# Altium project Fastino.PrjPCB (part 2 of 6)

## Sheet Fastino_FPGA.SchDoc: Fastino
size 420 x 297 mm; EDA_Number: ARTIQ; Projet: Fastino; Author: G.Kasprowicz; CompanyName: WUT ISE; DrawnBy: G.Kasprowicz; Organization: WUT ISE; Address1: PW ISE; Address2: Nowowiejska 15/19 00-665 Warsaw; Address3: gkasprow@gmail.com; DocumentNumber: 3; Revision: 2; SheetNumber: 3; SheetTotal: 8; ModifiedBy: -; CheckedDate: -; Title2: 3.3V FPGA banks; DivGrp: WUT ISE; Designer: G.Kasprowicz; ModifiedDate: -; ProjectName: Sensor Box
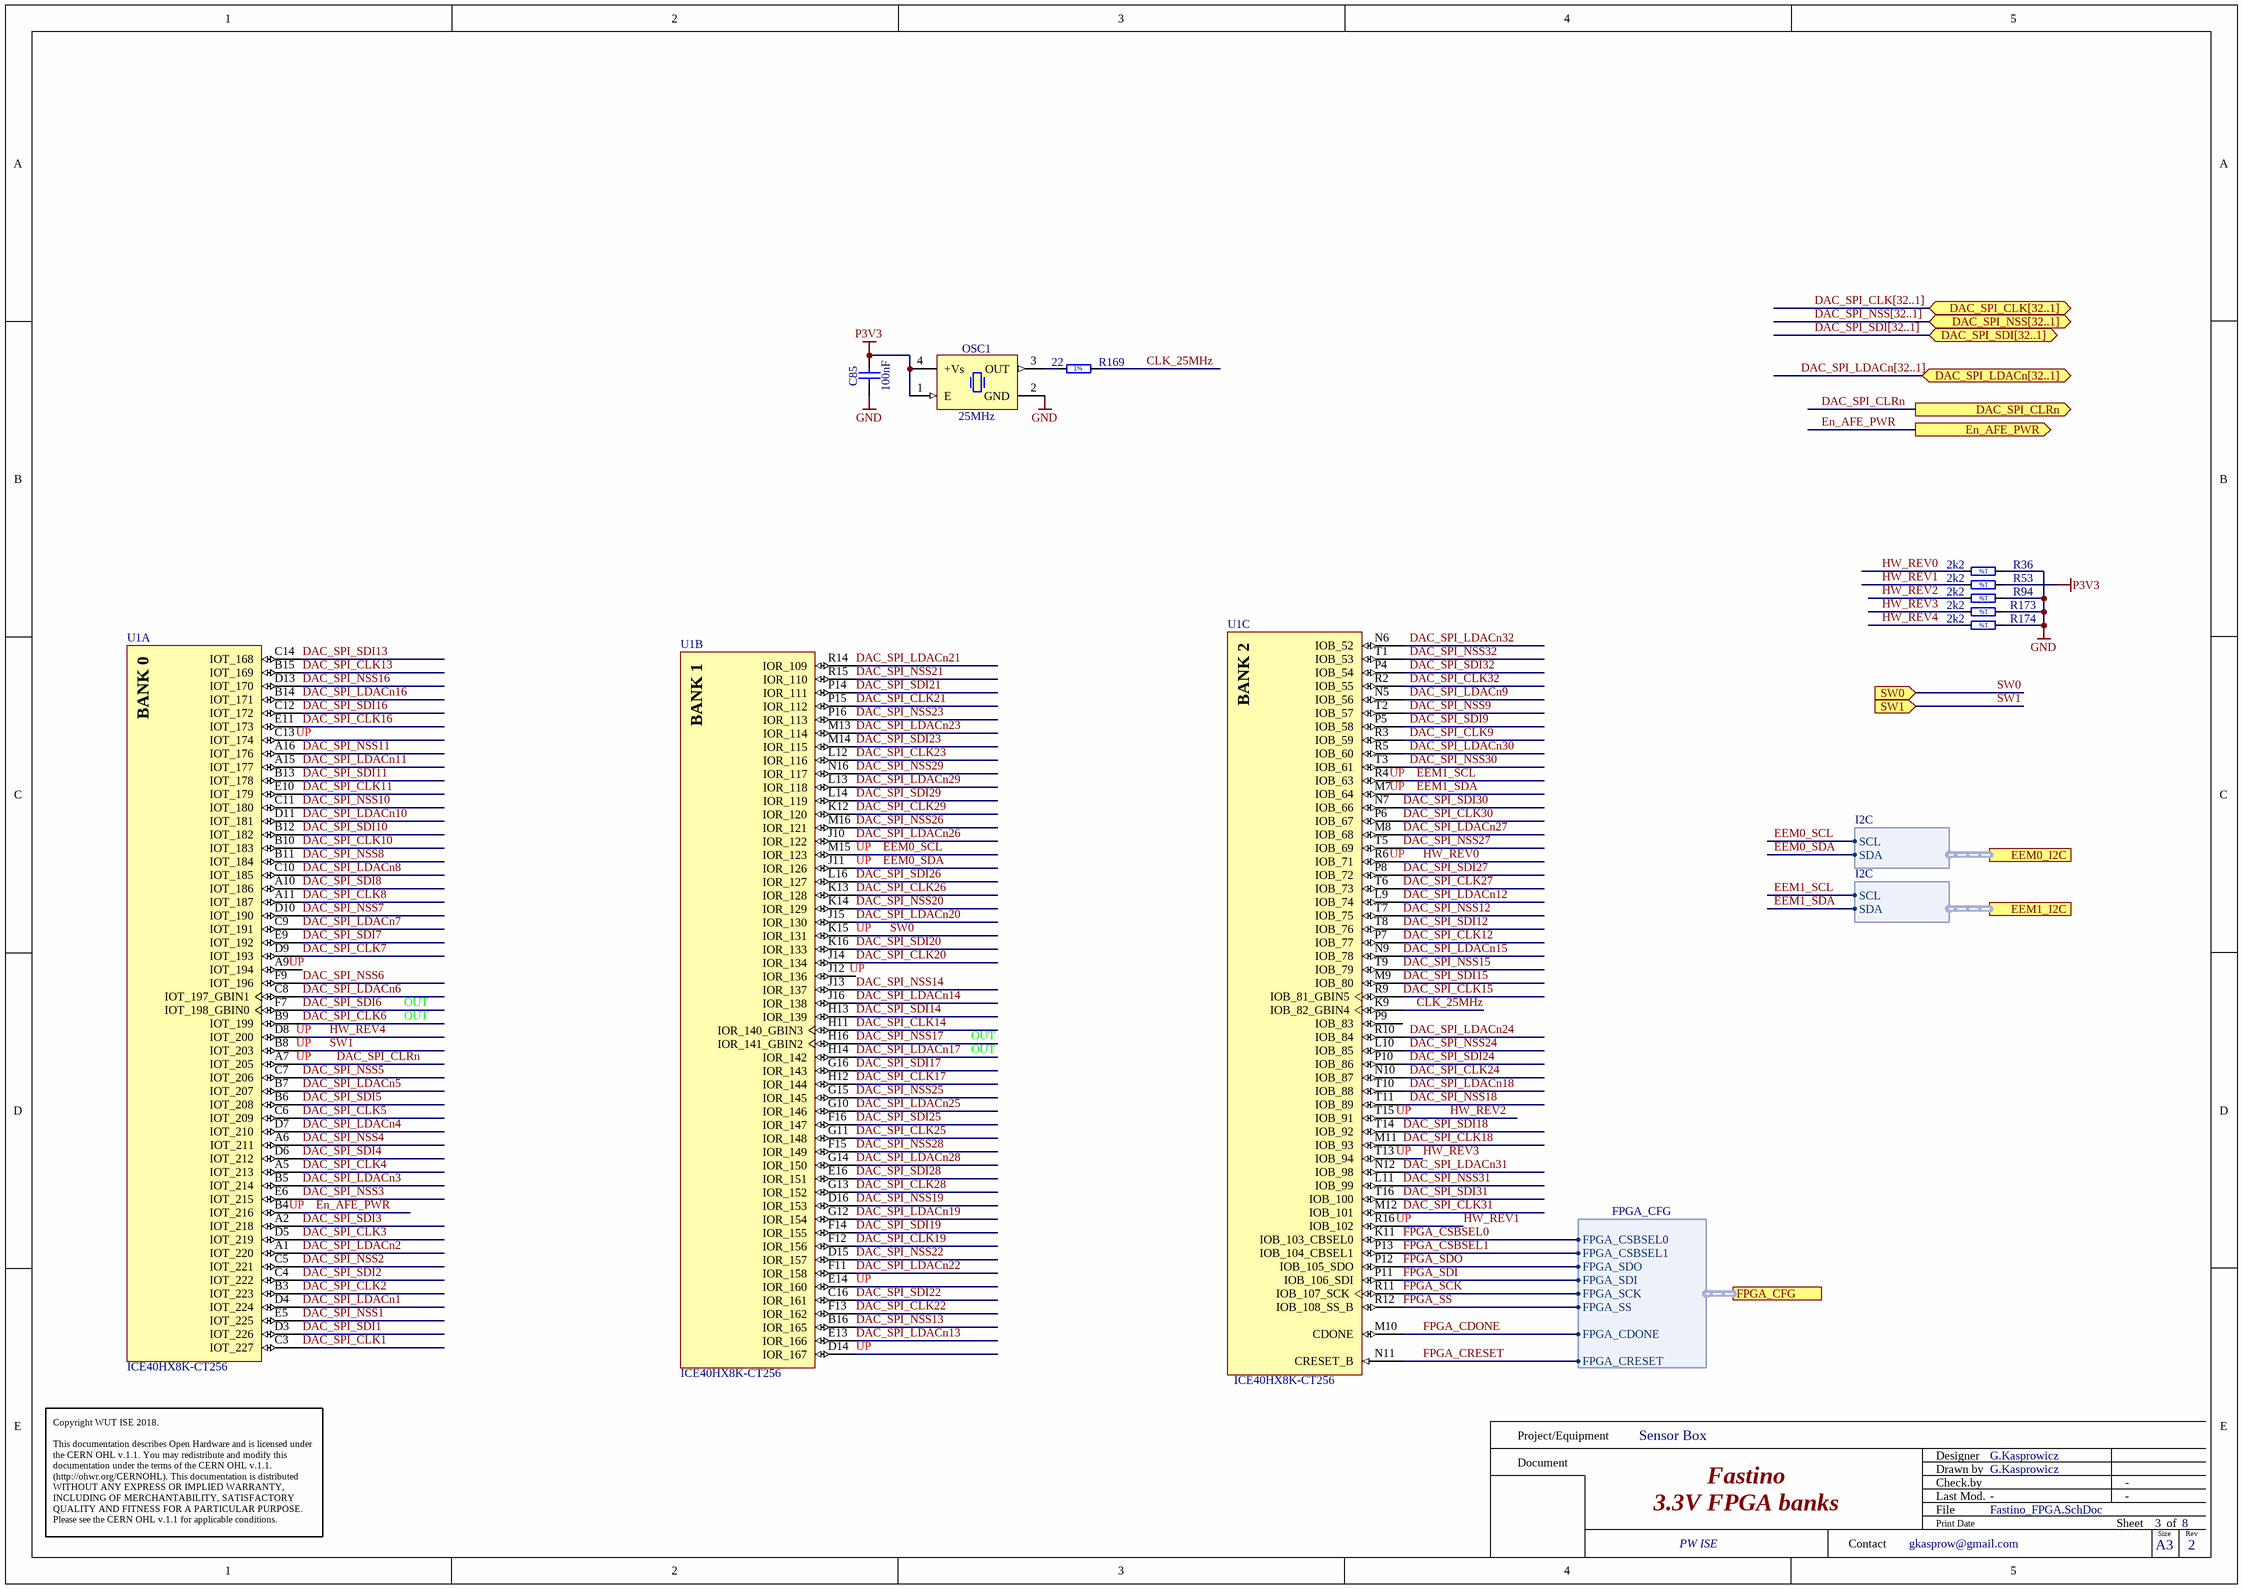
[diagram p2: Fastino_FPGA.SchDoc]

### Parts
C85  100nF  [CAPC1005X55N]
OSC1  25MHz  [OSC_IQD_CFPS-39]
R36  2k2  [RESC1005X40N]
R53  2k2  [RESC1005X40N]
R94  2k2  [RESC1005X40N]
R169  22  [RESC1005X40N]
R173  2k2  [RESC1005X40N]
R174  2k2  [RESC1005X40N]
U1  ICE40HX8K-CT256  [LATC-caBGA-256]  (parts A,B,C of 5)

### Ports
DAC_SPI_CLK[32..1] (bidir), DAC_SPI_CLRn (out), DAC_SPI_LDACn[32..1] (bidir), DAC_SPI_NSS[32..1] (bidir), DAC_SPI_SDI[32..1] (bidir), EEM0_I2C (harness I2C), EEM1_I2C (harness I2C), En_AFE_PWR (out), FPGA_CFG (harness FPGA_CFG), SW0 (in), SW1 (in)

### Harnesses
FPGA_CFG: FPGA_CSBSEL0, FPGA_CSBSEL1, FPGA_SDO, FPGA_SDI, FPGA_SCK, FPGA_SS, FPGA_CDONE, FPGA_CRESET
I2C: SDA, SCL

### Nets
GND: C85.1 OSC1.2(GND) R36.1 R94.1 R173.1 R174.1
P3V3: C85.2 OSC1.1(E) OSC1.4(+Vs) R53.1
CLK_25MHz: R169.2 U1.K9(IOB_82_GBIN4)
DAC_SPI_CLK1: U1.C3(IOT_227)
DAC_SPI_CLK2: U1.B3(IOT_223)
DAC_SPI_CLK3: U1.D5(IOT_219)
DAC_SPI_CLK4: U1.A5(IOT_213)
DAC_SPI_CLK5: U1.C6(IOT_209)
DAC_SPI_CLK6: U1.B9(IOT_199)
DAC_SPI_CLK7: U1.D9(IOT_193)
DAC_SPI_CLK8: U1.A11(IOT_187)
DAC_SPI_CLK9: U1.R3(IOB_59)
DAC_SPI_CLK10: U1.B10(IOT_183)
DAC_SPI_CLK11: U1.E10(IOT_179)
DAC_SPI_CLK12: U1.P7(IOB_77)
DAC_SPI_CLK13: U1.B15(IOT_169)
DAC_SPI_CLK14: U1.H11(IOR_140_GBIN3)
DAC_SPI_CLK15: U1.R9(IOB_81_GBIN5)
DAC_SPI_CLK16: U1.E11(IOT_173)
DAC_SPI_CLK17: U1.H12(IOR_144)
DAC_SPI_CLK18: U1.M11(IOB_93)
DAC_SPI_CLK19: U1.F12(IOR_156)
DAC_SPI_CLK20: U1.J14(IOR_134)
DAC_SPI_CLK21: U1.P15(IOR_112)
DAC_SPI_CLK22: U1.F13(IOR_162)
DAC_SPI_CLK23: U1.L12(IOR_116)
DAC_SPI_CLK24: U1.N10(IOB_87)
DAC_SPI_CLK25: U1.G11(IOR_148)
DAC_SPI_CLK26: U1.K13(IOR_128)
DAC_SPI_CLK27: U1.T6(IOB_73)
DAC_SPI_CLK28: U1.G13(IOR_152)
DAC_SPI_CLK29: U1.K12(IOR_120)
DAC_SPI_CLK30: U1.P6(IOB_67)
DAC_SPI_CLK31: U1.M12(IOB_101)
DAC_SPI_CLK32: U1.R2(IOB_55)
DAC_SPI_CLRn: U1.A7(IOT_205) ; port DAC_SPI_CLRn
DAC_SPI_LDACn1: U1.D4(IOT_224)
DAC_SPI_LDACn2: U1.A1(IOT_220)
DAC_SPI_LDACn3: U1.B5(IOT_214)
DAC_SPI_LDACn4: U1.D7(IOT_210)
DAC_SPI_LDACn5: U1.B7(IOT_207)
DAC_SPI_LDACn6: U1.C8(IOT_197_GBIN1)
DAC_SPI_LDACn7: U1.C9(IOT_191)
DAC_SPI_LDACn8: U1.C10(IOT_185)
DAC_SPI_LDACn9: U1.N5(IOB_56)
DAC_SPI_LDACn10: U1.D11(IOT_181)
DAC_SPI_LDACn11: U1.A15(IOT_177)
DAC_SPI_LDACn12: U1.L9(IOB_74)
DAC_SPI_LDACn13: U1.E13(IOR_166)
DAC_SPI_LDACn14: U1.J16(IOR_138)
DAC_SPI_LDACn15: U1.N9(IOB_78)
DAC_SPI_LDACn16: U1.B14(IOT_171)
DAC_SPI_LDACn17: U1.H14(IOR_142)
DAC_SPI_LDACn18: U1.T10(IOB_88)
DAC_SPI_LDACn19: U1.G12(IOR_154)
DAC_SPI_LDACn20: U1.J15(IOR_130)
DAC_SPI_LDACn21: U1.R14(IOR_109)
DAC_SPI_LDACn22: U1.F11(IOR_158)
DAC_SPI_LDACn23: U1.M13(IOR_114)
DAC_SPI_LDACn24: U1.R10(IOB_84)
DAC_SPI_LDACn25: U1.G10(IOR_146)
DAC_SPI_LDACn26: U1.J10(IOR_122)
DAC_SPI_LDACn27: U1.M8(IOB_68)
DAC_SPI_LDACn28: U1.G14(IOR_150)
DAC_SPI_LDACn29: U1.L13(IOR_118)
DAC_SPI_LDACn30: U1.R5(IOB_60)
DAC_SPI_LDACn31: U1.N12(IOB_98)
DAC_SPI_LDACn32: U1.N6(IOB_52)
DAC_SPI_NSS1: U1.E5(IOT_225)
DAC_SPI_NSS2: U1.C5(IOT_221)
DAC_SPI_NSS3: U1.E6(IOT_215)
DAC_SPI_NSS4: U1.A6(IOT_211)
DAC_SPI_NSS5: U1.C7(IOT_206)
DAC_SPI_NSS6: U1.F9(IOT_196)
DAC_SPI_NSS7: U1.D10(IOT_190)
DAC_SPI_NSS8: U1.B11(IOT_184)
DAC_SPI_NSS9: U1.T2(IOB_57)
DAC_SPI_NSS10: U1.C11(IOT_180)
DAC_SPI_NSS11: U1.A16(IOT_176)
DAC_SPI_NSS12: U1.T7(IOB_75)
DAC_SPI_NSS13: U1.B16(IOR_165)
DAC_SPI_NSS14: U1.J13(IOR_137)
DAC_SPI_NSS15: U1.T9(IOB_79)
DAC_SPI_NSS16: U1.D13(IOT_170)
DAC_SPI_NSS17: U1.H16(IOR_141_GBIN2)
DAC_SPI_NSS18: U1.T11(IOB_89)
DAC_SPI_NSS19: U1.D16(IOR_153)
DAC_SPI_NSS20: U1.K14(IOR_129)
DAC_SPI_NSS21: U1.R15(IOR_110)
DAC_SPI_NSS22: U1.D15(IOR_157)
DAC_SPI_NSS23: U1.P16(IOR_113)
DAC_SPI_NSS24: U1.L10(IOB_85)
DAC_SPI_NSS25: U1.G15(IOR_145)
DAC_SPI_NSS26: U1.M16(IOR_121)
DAC_SPI_NSS27: U1.T5(IOB_69)
DAC_SPI_NSS28: U1.F15(IOR_149)
DAC_SPI_NSS29: U1.N16(IOR_117)
DAC_SPI_NSS30: U1.T3(IOB_61)
DAC_SPI_NSS31: U1.L11(IOB_99)
DAC_SPI_NSS32: U1.T1(IOB_53)
DAC_SPI_SDI1: U1.D3(IOT_226)
DAC_SPI_SDI2: U1.C4(IOT_222)
DAC_SPI_SDI3: U1.A2(IOT_218)
DAC_SPI_SDI4: U1.D6(IOT_212)
DAC_SPI_SDI5: U1.B6(IOT_208)
DAC_SPI_SDI6: U1.F7(IOT_198_GBIN0)
DAC_SPI_SDI7: U1.E9(IOT_192)
DAC_SPI_SDI8: U1.A10(IOT_186)
DAC_SPI_SDI9: U1.P5(IOB_58)
DAC_SPI_SDI10: U1.B12(IOT_182)
DAC_SPI_SDI11: U1.B13(IOT_178)
DAC_SPI_SDI12: U1.T8(IOB_76)
DAC_SPI_SDI13: U1.C14(IOT_168)
DAC_SPI_SDI14: U1.H13(IOR_139)
DAC_SPI_SDI15: U1.M9(IOB_80)
DAC_SPI_SDI16: U1.C12(IOT_172)
DAC_SPI_SDI17: U1.G16(IOR_143)
DAC_SPI_SDI18: U1.T14(IOB_92)
DAC_SPI_SDI19: U1.F14(IOR_155)
DAC_SPI_SDI20: U1.K16(IOR_133)
DAC_SPI_SDI21: U1.P14(IOR_111)
DAC_SPI_SDI22: U1.C16(IOR_161)
DAC_SPI_SDI23: U1.M14(IOR_115)
DAC_SPI_SDI24: U1.P10(IOB_86)
DAC_SPI_SDI25: U1.F16(IOR_147)
DAC_SPI_SDI26: U1.L16(IOR_127)
DAC_SPI_SDI27: U1.P8(IOB_72)
DAC_SPI_SDI28: U1.E16(IOR_151)
DAC_SPI_SDI29: U1.L14(IOR_119)
DAC_SPI_SDI30: U1.N7(IOB_66)
DAC_SPI_SDI31: U1.T16(IOB_100)
DAC_SPI_SDI32: U1.P4(IOB_54)
EEM0_SCL: U1.M15(IOR_123) ; port EEM0_I2C.SCL
EEM0_SDA: U1.J11(IOR_126) ; port EEM0_I2C.SDA
EEM1_SCL: U1.R4(IOB_63) ; port EEM1_I2C.SCL
EEM1_SDA: U1.M7(IOB_64) ; port EEM1_I2C.SDA
En_AFE_PWR: U1.B4(IOT_216) ; port En_AFE_PWR
FPGA_CDONE: U1.M10(CDONE) ; port FPGA_CFG.FPGA_CDONE
FPGA_CRESET: U1.N11(CRESET_B) ; port FPGA_CFG.FPGA_CRESET
FPGA_CSBSEL0: U1.K11(IOB_103_CBSEL0) ; port FPGA_CFG.FPGA_CSBSEL0
FPGA_CSBSEL1: U1.P13(IOB_104_CBSEL1) ; port FPGA_CFG.FPGA_CSBSEL1
FPGA_SCK: U1.R11(IOB_107_SCK) ; port FPGA_CFG.FPGA_SCK  [project net FLASH_SCK]
FPGA_SDI: U1.P11(IOB_106_SDI) ; port FPGA_CFG.FPGA_SDI  [project net FLASH_SDO]
FPGA_SDO: U1.P12(IOB_105_SDO) ; port FPGA_CFG.FPGA_SDO  [project net FLASH_SDI]
FPGA_SS: U1.R12(IOB_108_SS_B) ; port FPGA_CFG.FPGA_SS  [project net FLASH_SS]
HW_REV0: R36.2 U1.R6(IOB_71)
HW_REV1: R53.2 U1.R16(IOB_102)
HW_REV2: R94.2 U1.T15(IOB_91)
HW_REV3: R173.2 U1.T13(IOB_94)
HW_REV4: R174.2 U1.D8(IOT_200)
SW0: U1.K15(IOR_131) ; port SW0
SW1: U1.B8(IOT_203) ; port SW1
NetOSC1_3: OSC1.3(OUT) R169.1

Not connected (* = marked no-connect by the designer): U1 A9(IOT_194) C13(IOT_174) D14(IOR_167) E14(IOR_160) J12(IOR_136) P9(IOB_83)

### Buses and harness runs
bus DAC_SPI_CLK[32..1] = port DAC_SPI_CLK[32..1]
bus DAC_SPI_LDACn[32..1] = port DAC_SPI_LDACn[32..1]
bus DAC_SPI_NSS[32..1] = port DAC_SPI_NSS[32..1]
bus DAC_SPI_SDI[32..1] = port DAC_SPI_SDI[32..1]

### Notes on the sheet
- (near U1) UP
- OUT
- Project/Equipment
- Document
- Designer
- Drawn by
- Check.by
- Copyright WUT ISE 2018.
  This documentation describes Open Hardware and is licensed under the CERN OHL v.1.1. You may redistribute and modify this documentation under the terms of the CERN OHL v.1.1. (http://ohwr.org/CERNOHL). This documentation is distributed WITHOUT ANY EXPRESS OR IMPLIED WARRANTY, INCLUDING OF MERCHANTABILITY, SATISFACTORY QUALITY AND FITNESS FOR A PARTICULAR PURPOSE. Please see the CERN OHL v.1.1 for applicable conditions.
- Contact
- File
- Last Mod.
- Print Date
- Sheet
- Size
- A3
- of
- Rev
- (in symbol CMP-0962-00001-1, part A) BANK 0
- (in symbol CMP-0962-00001-1, part B) BANK 1
- (in symbol CMP-0962-00001-1, part C) BANK 2
- (in symbol R0402_2K2_1%_0.0625W_100PPM) 1%
- (in symbol R0402_22R_1%_0.0625W_100PPM) 1%

### Library data of the parts
C85 = CC0402_100NF_16V_10%_X5R: Non-polarised capacitor; Part Description: SMD Multilayer Chip Ceramic Capacitor; Manufacturer: GENERIC; Manufacturer1 Part Number: GRM155R61C104KA88D; Voltage: 16V; TC: X5R; Tolerance: ±10%; Part Number: CC0402_100NF_16V_10%_X5R; Component Kind: Standard; Component Type: Standard; Pin Count: 2; Value: 100nF; Status: None; Manufacturer Part Number: CC0402_100NF_16V_10%_X5R; Case: 0402; Mounted: Yes; Socket: No; SMD: Yes; Sense: No; Manufacturer1 Example: MURATA; Manufacturer1 ComponentHeight: 0.55mm; HelpURL: \\cern.ch\dfs\Applications\Altium\Datasheets\CC0402_X5R_MURATA_GRM.pdf; Author: CERN DEM JLC; CreateDate: 10.12.2013; LatestRevisionDate: 10.12.2013
OSC1 = OSC_25MHZ_IQD_LFSPXO025165: Oscillator 4 pins 1=E 2=GND 3=OUT 4=+Vs; Part Description: 3.3V, ±50ppm, 15pF, -40 to 85°C, CMOS Surface Mount Clock Oscillator (CFPS-39 Series); Manufacturer: IQD FREQUENCY PRODUCTS; PressFit: No; Bonding: No; Part Number: OSC_25MHZ_IQD_LFSPXO025165; Component Kind: Standard; Component Type: Standard; PackageDescription: Oscillator, Corner Concave, 2.20mm Pitch, 4 Pins, 2.70mm L X 3.40mm W X 1.20mm H, CFPS-39 Series; Value: 25MHz; Manufacturer Part Number: LFSPXO025165; Pin Count: 4; Mounted: Yes; Socket: No; SMD: Yes; Sense: No; ComponentHeight: 1.2mm; HelpURL: \\cern.ch\dfs\Applications\Altium\Datasheets\OSC_IQD_LFSPXO025165.pdf; Author: CERN DEM JLC; CreateDate: 02.12.2010; LatestRevisionDate: 03.11.2016
R36 R53 R94 R173 R174 = R0402_2K2_1%_0.0625W_100PPM: Resistor - 1%; Part Description: General Purpose Thick Film Chip Resistor; Manufacturer: GENERIC; Manufacturer1 Part Number: 232270672202L; TC: ±100ppm/°C; Table: Resistors SMD; Part Number: R0402_2K2_1%_0.0625W_100PPM; Component Kind: Standard; Component Type: Standard; Pin Count: 2; Value: 2k2; Status: Not recommended; Power: 0.0625W; Tolerance: ±1%; Manufacturer Part Number: R0402_2K2_1%_0.0625W_100PPM; Case: 0402; Mounted: Yes; Socket: No; SMD: Yes; Manufacturer1 Example: YAGEO PHYCOMP; Manufacturer1 ComponentHeight: 0.4mm; HelpURL: \\cern.ch\dfs\Applications\Altium\Datasheets\R0402_Phycomp_RC0402.pdf; Author: CERN DEM JLC; CreateDate: 2007-12-03; LatestRevisionDate: 2012-10-17
R169 = R0402_22R_1%_0.0625W_100PPM: Resistor - 1%; Part Description: General Purpose Thick Film Chip Resistor; Manufacturer: GENERIC; Manufacturer1 Part Number: 232270672209L; TC: ±100ppm/°C; PressFit: No; Part Number: R0402_22R_1%_0.0625W_100PPM; Component Kind: Standard; Component Type: Standard; Pin Count: 2; Value: 22; Status: Not Recommended; Power: 0.0625W; Tolerance: ±1%; Manufacturer Part Number: R0402_22R_1%_0.0625W_100PPM; Case: 0402; Mounted: Yes; Sense: No; Socket: No; SMD: Yes; Manufacturer1 Example: YAGEO PHYCOMP; Manufacturer1 ComponentHeight: 0.4mm; HelpURL: \\cern.ch\dfs\Applications\Altium\Datasheets\R0402_Phycomp_RC0402.pdf; Author: CERN DEM JLC; CreateDate: 03/12/2007; LatestRevisionDate: 17/10/2012
U1 = CMP-0962-00001-1: iCE40 HX8K Series FPGA Family, 7680 Logic Cells, 1.2 V Core, 128 K Embedded RAM Bits, 256-ball caBGA, Pb-Free, Tray; Manufacturer: Lattice Semiconductor; Supply Voltage: 1.2V; Phase-Locked Loops: 2; Logic Cells: 7680; Embedded RAM Bits: 128K; PackageReference: caBGA-256; PackageDescription: 256-Ball Chip Array Ball Grid Array, Body 14 x 14 mm, Pitch 0.8 mm; RoHS: TRUE; Packing: Tray; Mounting Technology: Surface Mount; ComponentLink3URL: http://www.latticesemi.com/lit/docs/package/pkg.pdf; ComponentLink1Description: Manufacturer URL; ComponentLink3Description: Package Specification; Code_JEDEC: MO-275; PackageVersion: Rev. 03.9, 02/2013; ComponentLink1URL: http://www.latticesemi.com/en; ComponentLink2URL: http://www.latticesemi.com/~/media/Documents/DataSheets/iCE/iCE40LPHXFamilyDataSheet.pdf; PartNumber: ICE40HX8K-CT256; ComponentLink2Description: Datasheet; DatasheetVersion: Rev. 02.9

## Sheet Fastino_FPGA_Config.SchDoc: Fastino
size 420 x 297 mm; EDA_Number: ARTIQ; Projet: Fastino; Author: G.Kasprowicz; CompanyName: WUT ISE; DrawnBy: G.Kasprowicz; Organization: WUT ISE; Address1: PW ISE; Address2: Nowowiejska 15/19 00-665 Warsaw; Address3: gkasprow@gmail.com; DocumentNumber: 5; Revision: 2; SheetNumber: 8; SheetTotal: 12; ModifiedBy: -; CheckedDate: -; Title2: FPGA Configuration; DivGrp: WUT ISE; Designer: G.Kasprowicz; ModifiedDate: -; ProjectName: Sensor Box
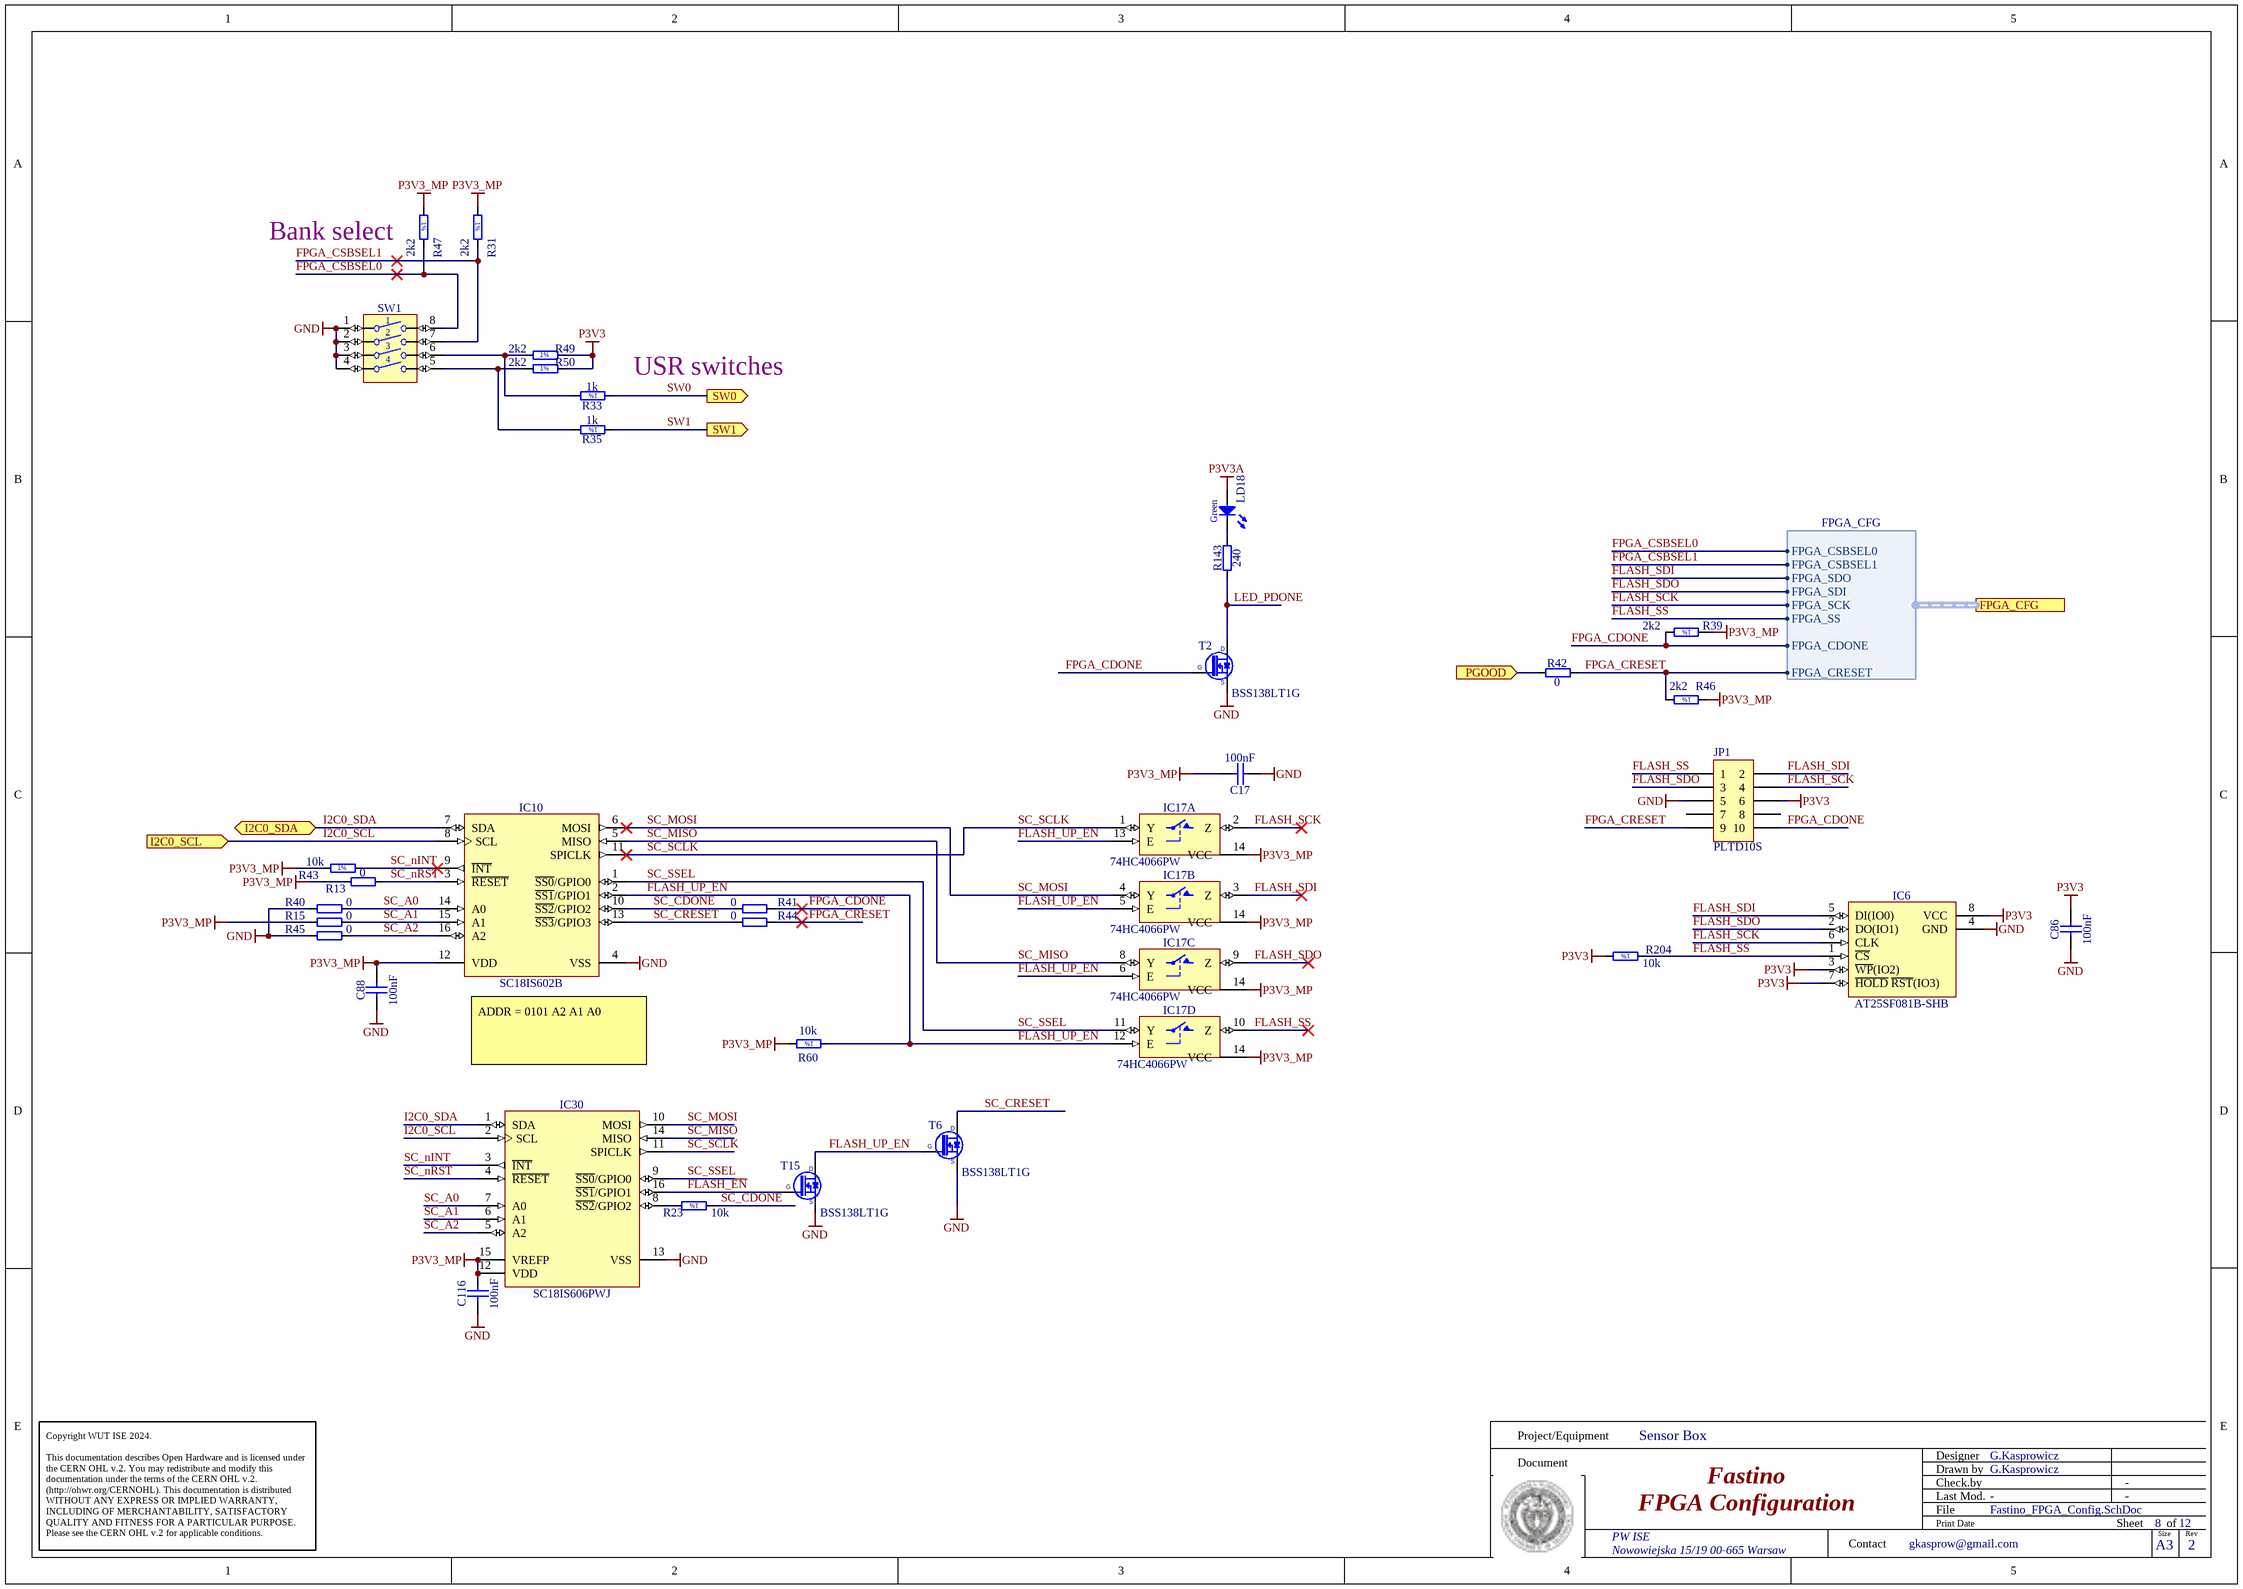
[diagram p3: Fastino_FPGA_Config.SchDoc]

### Parts
(Parts that share a designator on the sheet are numbered #1, #2 ... from top to bottom, then left to right.)
C17  100nF  [CAPC1005X55N]
C86  100nF  [CAPC1005X55N]
C88  100nF  [CAPC1005X55N]
C116  100nF  [CAPC1005X55N]
IC6  AT25SF081B-SHB  [SOIC127P790X216-8N]
IC10  SC18IS602B  [SOP65P640X110-16N]
IC17  74HC4066PW  [SOP65P640X110-14N]  (parts A,B,C,D of 4)
IC30  SC18IS606PWJ  [SOP65P640X110-16N]
JP1  PLTD10S  [PLTD10S]
LD18  Green  [LED_AVAGO_HSME-C120]
R13  0  [RESC1005X40N]
R15  0  [RESC1005X40N]
R23#2  10k  [RESC1005X40N]
R31  2k2  [RESC1005X40N]
R33  1k  [RESC1005X40N]
R35  1k  [RESC1005X40N]
R39  2k2  [RESC1005X40N]
R40  0  [RESC1005X40N]
R41  0  [RESC1005X40N]
R42  0  [RESC1005X40N]
R43  10k  [RESC1005X40N]
R44  0  [RESC1005X40N]
R45  0  [RESC1005X40N]
R46  2k2  [RESC1005X40N]
R47  2k2  [RESC1005X40N]
R49  2k2  [RESC1005X40N]
R50  2k2  [RESC1005X40N]
R60  10k  [RESC1005X40N]
R143  240  [RESC1005X40N]
R204  10k  [RESC1005X40N]
SW1  Switch  [SW_TYCO_1571983-4]  (value not drawn)
T2  BSS138LT1G  [SOT95P240X110-3N]
T6  BSS138LT1G  [SOT95P240X110-3N]
T15  BSS138LT1G  [SOT95P240X110-3N]

### Ports
FPGA_CFG (harness FPGA_CFG), I2C0_SCL (in), I2C0_SDA (bidir), PGOOD (in), SW0 (out), SW1 (out)

### Harnesses
FPGA_CFG: FPGA_CSBSEL0, FPGA_CSBSEL1, FPGA_SDO, FPGA_SDI, FPGA_SCK, FPGA_SS, FPGA_CDONE, FPGA_CRESET

### Nets
GND: C17.1 C86.1 C88.1 C116.1 IC6.4(GND) IC10.4(VSS) IC17.7(GND) IC30.13(VSS) JP1.5 R40.2 R45.2 SW1.1 SW1.2 SW1.3 SW1.4 T2.2(S) T6.2(S) T15.2(S)
P3V3: C86.2 IC6.3(~{WP}(IO2)) IC6.7(~{HOLD}_~{RST}(IO3)) IC6.8(VCC) JP1.6 R49.2 R50.2 R204.2
P3V3_MP: C17.2 C88.2 C116.2 IC10.12(VDD) IC17.14(VCC) IC30.12(VDD) IC30.15(VREFP) R13.2 R15.2 R31.1 R39.1 R43.1 R46.1 R47.1 R60.2
P3V3A: LD18.2(A)
~{FLASH_EN}: IC30.16(~{SS1}/GPIO1) T15.1(G)
FLASH_SCK: IC6.6(CLK) IC17.2(Z) JP1.4 ; port FPGA_CFG.FPGA_SCK
FLASH_SDI: IC6.5(DI(IO0)) IC17.3(Z) JP1.2 ; port FPGA_CFG.FPGA_SDO
FLASH_SDO: IC6.2(DO(IO1)) IC17.9(Z) JP1.3 ; port FPGA_CFG.FPGA_SDI
FLASH_SS: IC6.1(~{CS}) IC17.10(Z) JP1.1 R204.1 ; port FPGA_CFG.FPGA_SS
FLASH_UP_EN: IC10.2(~{SS1}/GPIO1) IC17.5(E) IC17.6(E) IC17.12(E) IC17.13(E) R60.1 T6.1(G) T15.3(D)
FPGA_CDONE: JP1.10 R39.2 R41.1 T2.1(G) ; port FPGA_CFG.FPGA_CDONE
FPGA_CRESET: JP1.9 R42.2 R44.1 R46.2 ; port FPGA_CFG.FPGA_CRESET
FPGA_CSBSEL0: R47.2 SW1.8 ; port FPGA_CFG.FPGA_CSBSEL0
FPGA_CSBSEL1: R31.2 SW1.7 ; port FPGA_CFG.FPGA_CSBSEL1
I2C0_SCL: IC10.8(SCL) IC30.2(SCL) ; port I2C0_SCL
I2C0_SDA: IC10.7(SDA) IC30.1(SDA) ; port I2C0_SDA
LED_PDONE: R143.1 T2.3(D)
SC_A0: IC10.14(A0) IC30.7(A0) R40.1
SC_A1: IC10.15(A1) IC30.6(A1) R15.1
SC_A2: IC10.16(A2) IC30.5(A2) R45.1
SC_CDONE: IC10.10(~{SS2}/GPIO2) R23#2.1 R41.2
SC_CRESET: IC10.13(~{SS3}/GPIO3) R44.2 T6.3(D)
SC_MISO: IC10.5(MISO) IC17.8(Y) IC30.14(MISO)
SC_MOSI: IC10.6(MOSI) IC17.4(Y) IC30.10(MOSI)
SC_nINT: IC10.9(~{INT}) IC30.3(~{INT}) R43.2
SC_nRST: IC10.3(~{RESET}) IC30.4(~{RESET}) R13.1
SC_SCLK: IC10.11(SPICLK) IC17.1(Y) IC30.11(SPICLK)
SC_SSEL: IC10.1(~{SS0}/GPIO0) IC17.11(Y) IC30.9(~{SS0}/GPIO0)
SW0: R33.1 ; port SW0
SW1: R35.1 ; port SW1
NetIC30_8: IC30.8(~{SS2}/GPIO2) R23#2.2
NetLD18_1: LD18.1(C) R143.2
NetR33_2: R33.2 R49.1 SW1.6
NetR35_2: R35.2 R50.1 SW1.5
NetR42_1: R42.1 ; port PGOOD

Not connected (* = marked no-connect by the designer): JP1 7 8

### Notes on the sheet
- (near R47) Bank select
- (near R33) USR switches
- (near IC10) ADDR = 0101 A2 A1 A0
- Project/Equipment
- Document
- Designer
- Drawn by
- Check.by
- Copyright WUT ISE 2024.
  This documentation describes Open Hardware and is licensed under the CERN OHL v.2. You may redistribute and modify this documentation under the terms of the CERN OHL v.2. (http://ohwr.org/CERNOHL). This documentation is distributed WITHOUT ANY EXPRESS OR IMPLIED WARRANTY, INCLUDING OF MERCHANTABILITY, SATISFACTORY QUALITY AND FITNESS FOR A PARTICULAR PURPOSE. Please see the CERN OHL v.2 for applicable conditions.
- Contact
- File
- Last Mod.
- Print Date
- Sheet
- Size
- A3
- of
- Rev
- (in symbol R0402_1K_1%_0.0625W_100PPM) 1%
- (in symbol R0402_2K2_1%_0.0625W_100PPM) 1%
- (in symbol R0402_10K_1%_0.0625W_100PPM) 1%

### Library data of the parts
C17 C86 C88 C116 = CC0402_100NF_16V_10%_X5R: as C85 on sheet Fastino_FPGA; Part Number: CC0402_100NF_16V_10%_X5R; Component Kind: Standard; Component Type: Standard; Pin Count: 2; Value: 100nF; Status: None; Manufacturer Part Number: CC0402_100NF_16V_10%_X5R; Case: 0402; Mounted: Yes; Socket: No; SMD: Yes; Sense: No; Manufacturer1 Example: MURATA; Manufacturer1 ComponentHeight: 0.55mm; HelpURL: \\cern.ch\dfs\Applications\Altium\Datasheets\CC0402_X5R_MURATA_GRM.pdf; Author: CERN DEM JLC; CreateDate: 10.12.2013; LatestRevisionDate: 10.12.2013
IC6 = MEM_AT25SF081B-SHB: 8M-bit Serial Flash Memory with uniform 4KB sectors and Dual/Quad SPI and QPI; Manufacturer: Renesas; PressFit: No; Bonding: No; Part Number: AT25SF081B-SHB; Component Kind: Standard; Component Type: Standard; Device: AT25SF081B-SHB; PackageDescription: SOIC, 1.27mm Pitch; 8 Pin, 5.285mm W X 5.335mm L X 2.16mm H body, IPC Medium Density; Part Description: 8M-bit Serial Flash Memory with uniform 4KB sectors and Dual/Quad SPI and QPI; Manufacturer Part Number: AT25SF081B-SHB; Pin Count: 8; Case: SOIC8; Mounted: Yes; Socket: No; SMD: Yes; Sense: No; ComponentHeight: 2.16mm; HelpURL: \\cern.ch\dfs\Applications\Altium\Datasheets\W25Q128FVSIG.pdf; Author: GK; CreateDate: 26/01/2018; LatestRevisionDate: 26/01/2018
IC10 = SC18IS602B: I2C-bus to SPI bridge; Manufacturer: NXP SEMICONDUCTORS; PressFit: No; Bonding: No; Part Number: SC18IS602B; Component Kind: Standard; Component Type: Standard; Device: SC18IS602B; PackageDescription: SOP, 0.65mm pitch; 16 pin, 4.40mm W X 5.00mm L X 1.10mm H body IPC Medium Density; Part Description: I2C-Bus to SPI Bridge; Manufacturer Part Number: SC18IS602B; Pin Count: 16; Case: TSSOP16; Mounted: Yes; Socket: No; SMD: Yes; Sense: No; ComponentHeight: 1.1mm; HelpURL: \\cern.ch\dfs\Applications\Altium\Datasheets\SC18IS602B.pdf; Author: CERN DEM MR; CreateDate: 14/12/2015; LatestRevisionDate: 14/12/2015
IC17 = 74HC4066PW: Part Description: Quad Single-Pole Single-Throw Analog Switch; Manufacturer: NXP SEMICONDUCTORS; PressFit: No; Bonding: No; Table: Standard Logic; Part Number: 74HC4066PW; Component Kind: Standard; Component Type: Standard; Device: 74HC4066PW; PackageDescription: SOP, 14-Leads, Body 4.4x5mm (max), Pitch 0.65mm, IPC Medium Density; Manufacturer Part Number: 74HC4066PW; Pin Count: 14; Case: TSSOP14; Mounted: Yes; Socket: No; SMD: Yes; ComponentHeight: 1.1mm; Author: CERN DEM JLC; HelpURL: \\cern.ch\dfs\Applications\Altium\Datasheets\74HC4066PW.pdf; CreateDate: 2014-11-19; LatestRevisionDate: 2014-11-19
IC30 = SC18IS606PWJ: I2C-bus to SPI bridge; Manufacturer: NXP SEMICONDUCTORS; PressFit: No; Bonding: No; Part Number: SC18IS606PWJ; Component Kind: Standard; Component Type: Standard; Device: SC18IS606PWJ; PackageDescription: SOP, 0.65mm pitch; 16 pin, 4.40mm W X 5.00mm L X 1.10mm H body IPC Medium Density; Part Description: I2C-Bus to SPI Bridge; Manufacturer Part Number: SC18IS606PWJ; Pin Count: 16; Case: TSSOP16; Mounted: Yes; Socket: No; SMD: Yes; Sense: No; ComponentHeight: 1.1mm; HelpURL: \\cern.ch\dfs\Applications\Altium\Datasheets\SC18IS602B.pdf; Author: GK; CreateDate: 14/12/2015; LatestRevisionDate: 14/12/2015
JP1 = CON_2x5 2.54 male SMT: Goldpin 2.54mm, male header; Manufacturer: Maritex; Manufacturer Part Number: PLTD10S
LD18 = LED_AVAGO_HSME-C120: LED Green 1C 2A; Part Description: High Performance Right Angle Chip Green LED; Manufacturer: AVAGO TECHNOLOGIES; PressFit: No; Bonding: No; Part Number: LED_AVAGO_HSME-C120; Component Kind: Standard; Component Type: Standard; Color: Green; PackageDescription: Green Chip LED, 2-Leads, Body 1.7x1.1mm, Side Emitting Package; Manufacturer Part Number: HSME-C120; Pin Count: 2; Mounted: Yes; Socket: No; SMD: Yes; Sense: No; ComponentHeight: 0.7mm; HelpURL: \\cern.ch\dfs\Applications\Altium\Datasheets\LED_AVAGO_HSME-C120.pdf; ComponentLink1URL: \\cern.ch\dfs\Applications\Altium\Datasheets\LED_AVAGO_HSME-C110_DESIGN-GUIDE.pdf; ComponentLink1Description: Design Guide; Author: CERN DEM JMW; CreateDate: 22.07.2009; LatestRevisionDate: 20.06.2012
R13 R15 R40-R42 R44 R45 = R0402_0R_JUMPER: as R153 on sheet Fastino_DAC_channel; Part Number: R0402_0R_JUMPER; Component Kind: Standard; Component Type: Standard; Pin Count: 2; Value: 0; Status: Not Recommended; Manufacturer Part Number: R0402_0R_JUMPER; Case: 0402; Mounted: Yes; Socket: No; SMD: Yes; Manufacturer1 Example: YAGEO PHYCOMP; Manufacturer1 ComponentHeight: 0.4mm; HelpURL: \\cern.ch\dfs\Applications\Altium\Datasheets\R0402_Phycomp_RC0402.pdf; Author: CERN DEM JLC; CreateDate: 03.12.2007; LatestRevisionDate: 17.10.2012; Sense: No
R23#2 R43 R60 R204 = R0402_10K_1%_0.0625W_100PPM: Resistor - 1%; Part Description: General Purpose Thick Film Chip Resistor; Manufacturer: GENERIC; Manufacturer1 Part Number: 232270671003L; TC: ±100ppm/°C; Table: Resistors SMD; Part Number: R0402_10K_1%_0.0625W_100PPM; Component Kind: Standard; Component Type: Standard; Pin Count: 2; Value: 10k; Status: Not recommended; Power: 0.0625W; Tolerance: ±1%; Manufacturer Part Number: R0402_10K_1%_0.0625W_100PPM; Case: 0402; Mounted: Yes; Socket: No; SMD: Yes; Manufacturer1 Example: YAGEO PHYCOMP; Manufacturer1 ComponentHeight: 0.4mm; HelpURL: \\cern.ch\dfs\Applications\Altium\Datasheets\R0402_Phycomp_RC0402.pdf; Author: CERN DEM JLC; CreateDate: 2007-12-03; LatestRevisionDate: 2012-10-17
R31 R39 R46 R47 R49 R50 = R0402_2K2_1%_0.0625W_100PPM: as R36 on sheet Fastino_FPGA; Part Number: R0402_2K2_1%_0.0625W_100PPM; Component Kind: Standard; Component Type: Standard; Pin Count: 2; Value: 2k2; Status: Not recommended; Power: 0.0625W; Tolerance: ±1%; Manufacturer Part Number: R0402_2K2_1%_0.0625W_100PPM; Case: 0402; Mounted: Yes; Socket: No; SMD: Yes; Manufacturer1 Example: YAGEO PHYCOMP; Manufacturer1 ComponentHeight: 0.4mm; HelpURL: \\cern.ch\dfs\Applications\Altium\Datasheets\R0402_Phycomp_RC0402.pdf; Author: CERN DEM JLC; CreateDate: 2007-12-03; LatestRevisionDate: 2012-10-17
R33 R35 = R0402_1K_1%_0.0625W_100PPM: Resistor - 1%; Part Description: General Purpose Thick Film Chip Resistor; Manufacturer: GENERIC; Manufacturer1 Part Number: 232270671002L; TC: ±100ppm/°C; PressFit: No; Part Number: R0402_1K_1%_0.0625W_100PPM; Component Kind: Standard; Component Type: Standard; Pin Count: 2; Value: 1k; Status: Not Recommended; Power: 0.0625W; Tolerance: ±1%; Manufacturer Part Number: R0402_1K_1%_0.0625W_100PPM; Case: 0402; Mounted: Yes; Socket: No; SMD: Yes; Manufacturer1 Example: YAGEO PHYCOMP; Manufacturer1 ComponentHeight: 0.4mm; HelpURL: \\cern.ch\dfs\Applications\Altium\Datasheets\R0402_Phycomp_RC0402.pdf; Author: CERN DEM JLC; CreateDate: 03.12.2007; LatestRevisionDate: 17.10.2012; Sense: No
R143 = R0402_240R_1%_0.0625W_100PPM: Resistor - 1%; Part Description: General Purpose Thick Film Chip Resistor; Manufacturer: GENERIC; Manufacturer1 Part Number: 232270672401L; TC: ±100ppm/°C; PressFit: No; Part Number: R0402_240R_1%_0.0625W_100PPM; Component Kind: Standard; Component Type: Standard; Pin Count: 2; Value: 240; Status: Not Recommended; Power: 0.0625W; Tolerance: ±1%; Manufacturer Part Number: R0402_240R_1%_0.0625W_100PPM; Case: 0402; Mounted: Yes; Sense: No; Socket: No; SMD: Yes; Manufacturer1 Example: YAGEO PHYCOMP; Manufacturer1 ComponentHeight: 0.4mm; HelpURL: \\cern.ch\dfs\Applications\Altium\Datasheets\R0402_Phycomp_RC0402.pdf; Author: CERN DEM JLC; CreateDate: 03.12.2007; LatestRevisionDate: 17.10.2012
SW1 = SW_TYCO_1571983-4: 4 Ways SPST DIP Switch; Part Description: 4 Way SPST SMD DIP Switch, Latched, Contact Rating 0.025A 24VDC; Manufacturer: TYCO; Manufacturer Part Number: 1571983-4 or GDH04S04; PressFit: No; Part Number: SW_TYCO_1571983-4; Component Kind: Standard; Component Type: Standard; Pin Count: 8; PackageDescription: Pitch 1.27mm,  Body 6.2x6.2mm, 4 Ways SPST Surface-Mount DIP Switch, TYCO GDH Series; Family: Switch; Mounted: Yes; Socket: No; SMD: Yes; Sense: No; Status: None; ComponentHeight: 2.31mm; HelpURL: \\cern.ch\dfs\Applications\Altium\Datasheets\SW_TYCO_1571983-4.pdf; Author: CERN DEM JLC; CreateDate: 08/01/2009; LatestRevisionDate: 08/01/2009
T2 T6 T15 = BSS138LT1G: N-CHANNEL MOSFET WITH DIODE; Part Description: 50V 200mA N-Channel Enhancement Mode Field-Effect Transistor; Manufacturer: ON SEMICONDUCTOR; PressFit: No; Bonding: No; Part Number: BSS138LT1G; Component Kind: Standard; Component Type: Standard; Device: BSS138LT1G; PackageDescription: SOT23 3-Leads, Pitch 0.95mm - Body 1.4x3mm, IPC Medium Density; Manufacturer Part Number: BSS138LT1G; Pin Count: 3; Case: SOT23-3; Mounted: Yes; Socket: No; SMD: Yes; Sense: No; ComponentHeight: 1.11mm; HelpURL: \\cern.ch\dfs\Applications\Altium\Datasheets\BSS138LT1G.pdf; Author: CERN DEM JLC; CreateDate: 23.03.2009; LatestRevisionDate: 23.03.2009